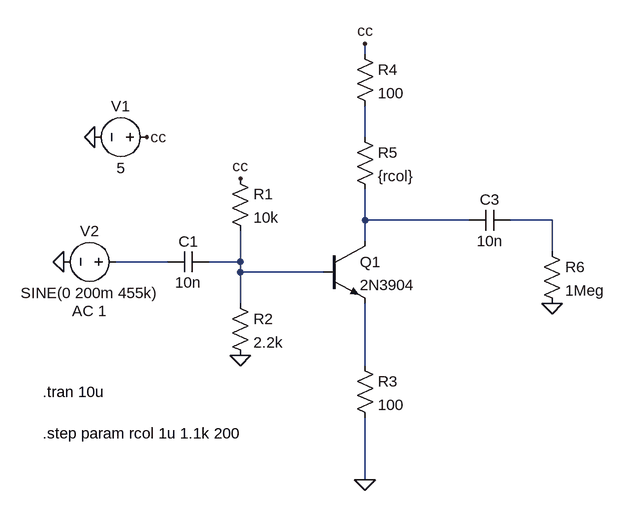
[diagram p0: schematic jw-variable.asc]
jw-variable.asc, the LTspice schematic file:
Version 4
SHEET 1 880 680
WIRE 384 -160 384 -176
WIRE 384 -32 384 -80
WIRE 384 96 384 48
WIRE 544 96 384 96
WIRE 672 96 608 96
WIRE 384 128 384 96
WIRE 672 144 672 96
WIRE 80 160 0 160
WIRE 192 160 192 112
WIRE 192 160 144 160
WIRE 192 176 192 160
WIRE 320 176 192 176
WIRE 192 224 192 176
WIRE 384 320 384 224
WIRE 384 496 384 400
FLAG 192 304 0
FLAG -32 -32 0
FLAG 48 -32 cc
FLAG 192 32 cc
FLAG 384 -176 cc
FLAG 384 496 0
FLAG 672 224 0
FLAG -80 160 0
SYMBOL cap 144 144 R90
WINDOW 0 0 32 VBottom 2
WINDOW 3 32 32 VTop 2
SYMATTR InstName C1
SYMATTR Value 10n
SYMBOL res 176 16 R0
SYMATTR InstName R1
SYMATTR Value 10k
SYMBOL res 176 208 R0
SYMATTR InstName R2
SYMATTR Value 2.2k
SYMBOL npn 320 128 R0
SYMATTR InstName Q1
SYMATTR Value 2N3904
SYMBOL res 368 304 R0
SYMATTR InstName R3
SYMATTR Value 100
SYMBOL res 368 -176 R0
SYMATTR InstName R4
SYMATTR Value 100
SYMBOL voltage 64 -32 R90
WINDOW 0 -32 56 VBottom 2
WINDOW 3 32 56 VTop 2
WINDOW 123 0 0 Left 0
WINDOW 39 0 0 Left 0
SYMATTR InstName V1
SYMATTR Value 5
SYMBOL cap 608 80 R90
WINDOW 0 0 32 VBottom 2
WINDOW 3 32 32 VTop 2
SYMATTR InstName C3
SYMATTR Value 10n
SYMBOL res 656 128 R0
SYMATTR InstName R6
SYMATTR Value 1Meg
SYMBOL voltage 16 160 R90
WINDOW 0 -32 56 VBottom 2
WINDOW 3 32 56 VTop 2
WINDOW 123 60 56 VTop 2
WINDOW 39 0 0 Left 0
SYMATTR InstName V2
SYMATTR Value SINE(0 200m 455k)
SYMATTR Value2 AC 1
SYMBOL res 368 -48 R0
SYMATTR InstName R5
SYMATTR Value {rcol}
TEXT -112 360 Left 2 !.tran 10u
TEXT -112 424 Left 2 !.step param rcol 1u 1.1k 200

The netlist it stands for:
* jw-variable.asc
C1 N005 N004 10n
R1 cc N005 10k
R2 N005 0 2.2k
Q1 N002 N005 N006 0 2N3904
R3 N006 0 100
R4 cc N001 100
V1 cc 0 5
C3 N003 N002 10n
R6 N003 0 1Meg
V2 N004 0 SINE(0 200m 455k) AC 1
R5 N001 N002 {rcol}
.model NPN NPN
.model PNP PNP
.lib standard.bjt
.tran 10u
.step param rcol 1u 1.1k 200
.backanno
.end